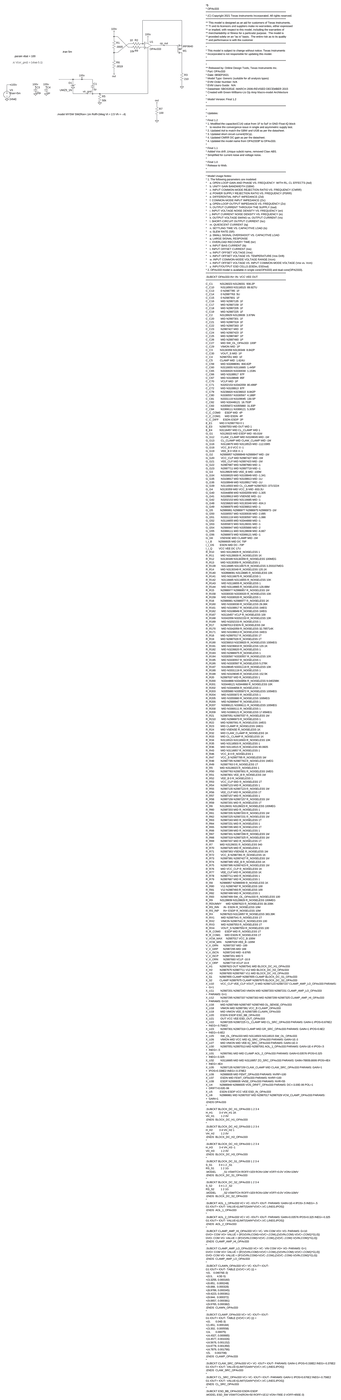
[diagram p0: schematic high_common_mode_shunt_opa333_mosfet.asc, whole sheet]
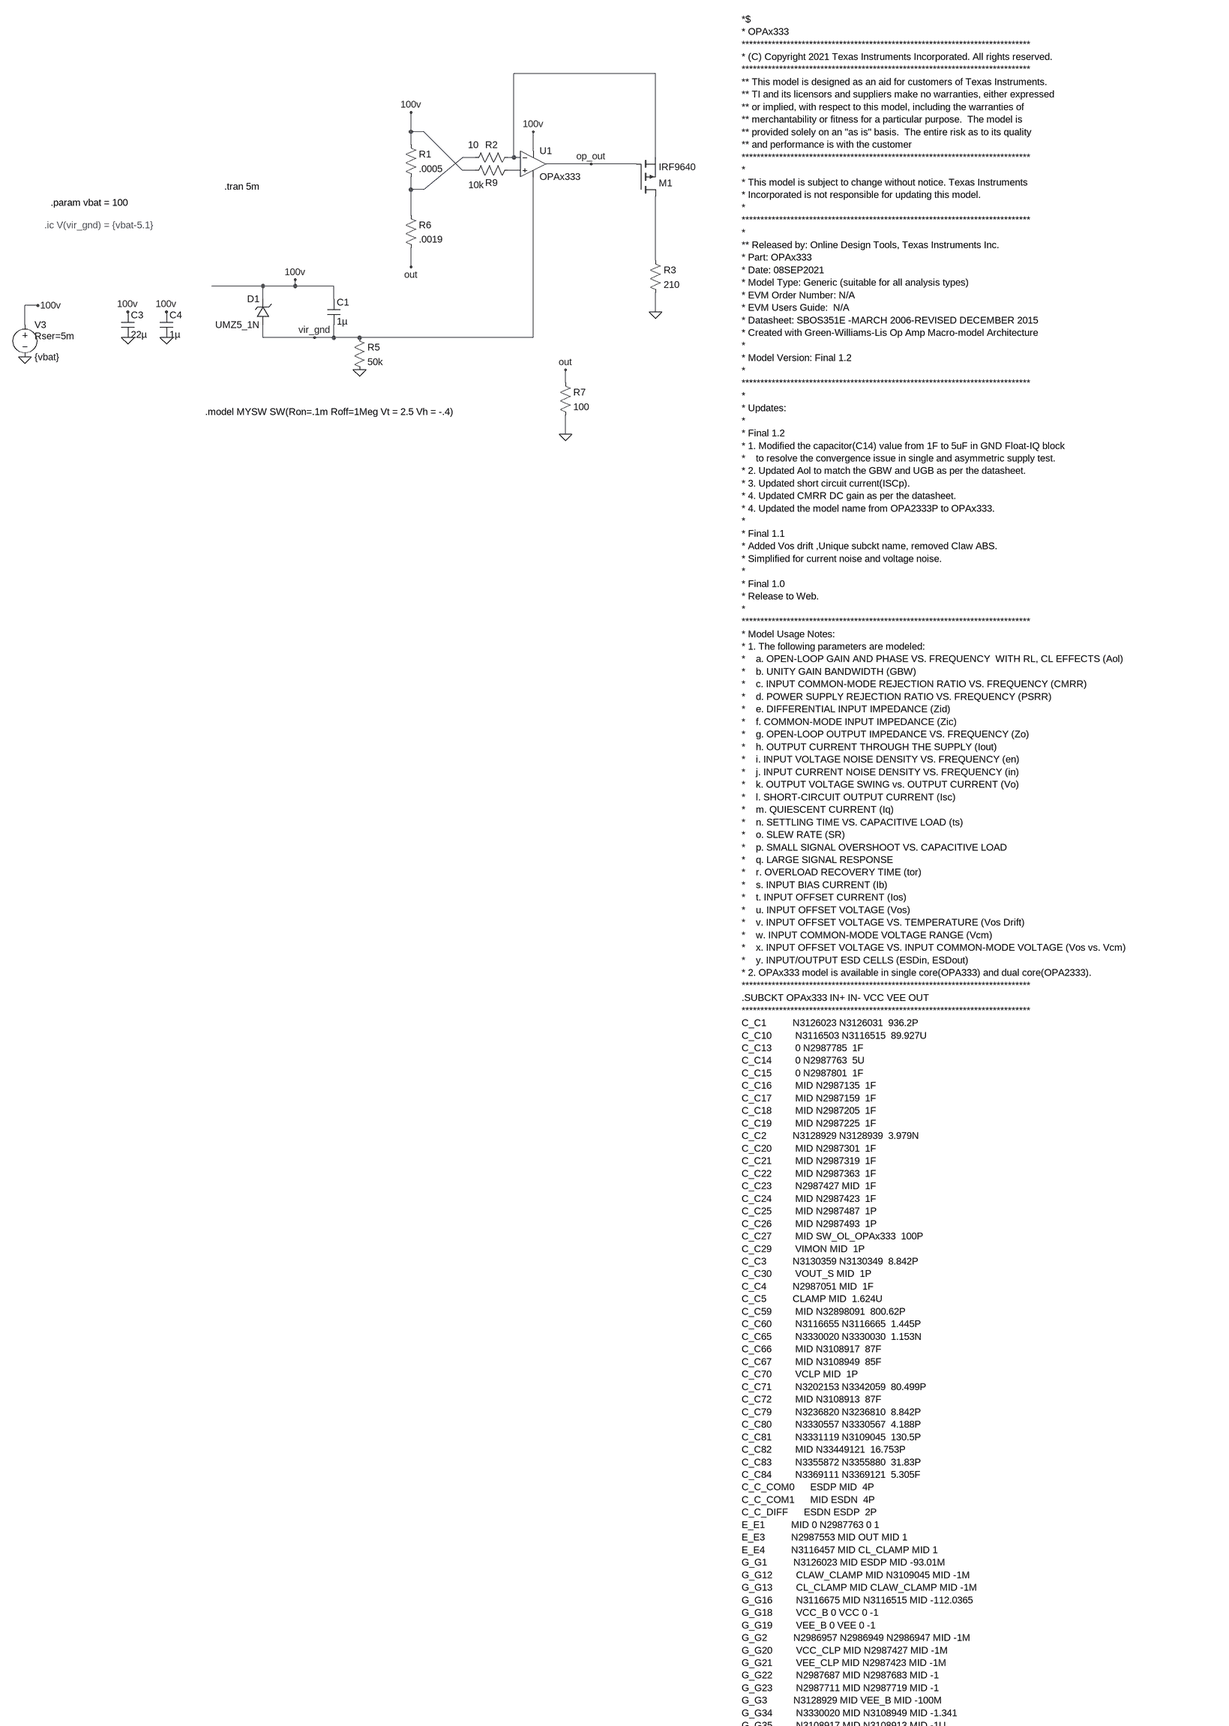
[diagram p1: schematic high_common_mode_shunt_opa333_mosfet.asc, part, row 1 of 3, column 1 of 1]
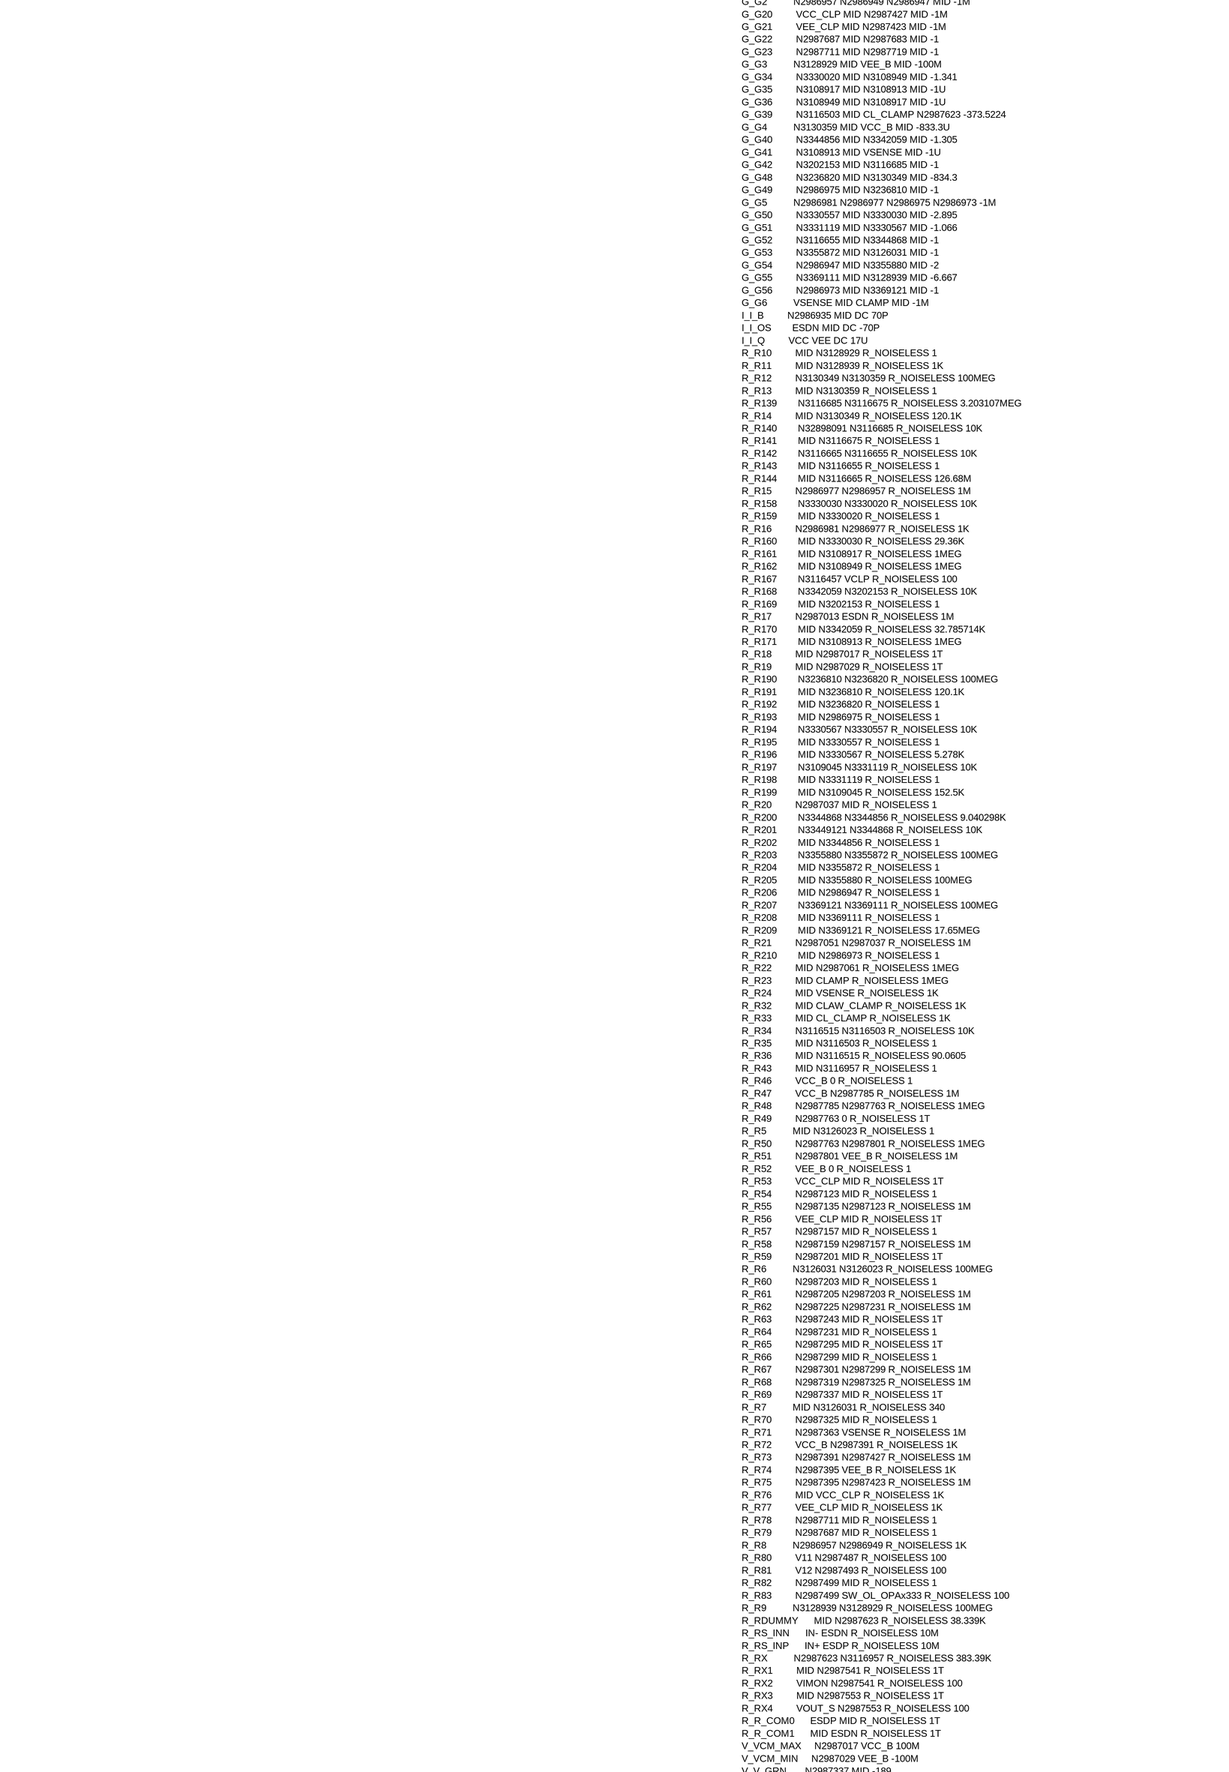
[diagram p2: schematic high_common_mode_shunt_opa333_mosfet.asc, part, row 2 of 3, column 1 of 1]
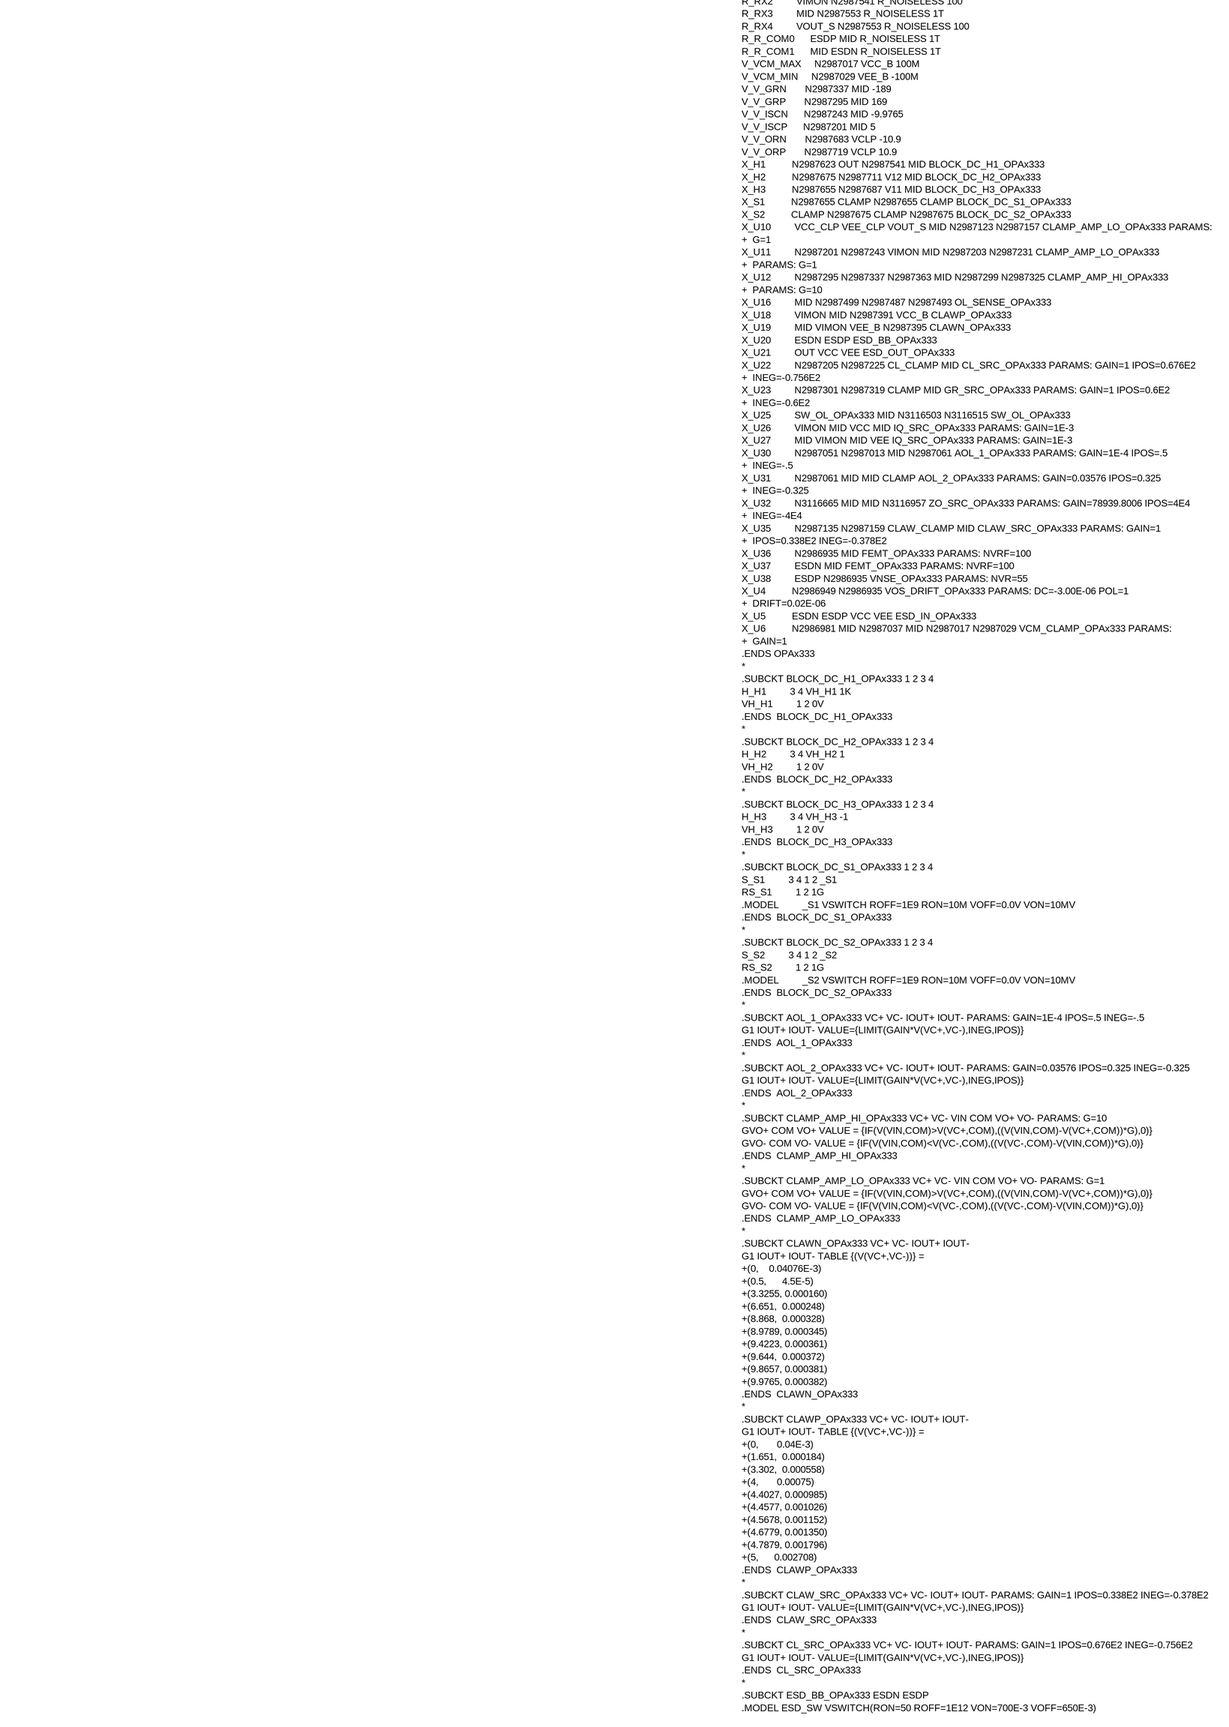
[diagram p3: schematic high_common_mode_shunt_opa333_mosfet.asc, part, row 3 of 3, column 1 of 1]
high_common_mode_shunt_opa333_mosfet.asc, the LTspice schematic file:
Version 4
SHEET 1 3060 12004
WIRE 256 -784 -96 -784
WIRE -352 -640 -352 -688
WIRE -320 -640 -352 -640
WIRE -352 -608 -352 -640
WIRE -48 -592 -48 -640
WIRE -192 -576 -224 -576
WIRE -96 -576 -96 -784
WIRE -96 -576 -112 -576
WIRE -80 -576 -96 -576
WIRE 256 -576 256 -784
WIRE 96 -560 -16 -560
WIRE 208 -560 96 -560
WIRE -224 -544 -320 -640
WIRE -192 -544 -224 -544
WIRE -80 -544 -112 -544
WIRE -352 -496 -352 -528
WIRE -320 -496 -224 -576
WIRE -320 -496 -352 -496
WIRE -352 -432 -352 -496
WIRE 256 -320 256 -480
WIRE -352 -304 -352 -352
WIRE -720 -256 -848 -256
WIRE -640 -256 -640 -272
WIRE -640 -256 -720 -256
WIRE -544 -256 -640 -256
WIRE -720 -224 -720 -256
WIRE -544 -224 -544 -256
WIRE -1280 -208 -1312 -208
WIRE 256 -192 256 -240
WIRE -1312 -160 -1312 -208
WIRE -720 -128 -720 -160
WIRE -592 -128 -720 -128
WIRE -544 -128 -544 -160
WIRE -544 -128 -592 -128
WIRE -480 -128 -544 -128
WIRE -48 -128 -48 -528
WIRE -48 -128 -480 -128
WIRE 32 -16 32 -48
WIRE 32 112 32 64
FLAG -352 -688 100v
FLAG -1312 -80 0
FLAG -1280 -208 100v
FLAG -48 -640 100v
FLAG -640 -272 100v
FLAG 96 -560 op_out
FLAG -352 -304 out
FLAG -480 -48 0
FLAG -592 -128 vir_gnd
FLAG -1056 -128 0
FLAG -1056 -192 100v
FLAG -960 -128 0
FLAG -960 -192 100v
FLAG 32 -48 out
FLAG 32 112 0
FLAG 256 -192 0
SYMBOL res -368 -624 R0
SYMATTR InstName R1
SYMATTR Value .0005
SYMBOL voltage -1312 -176 R0
WINDOW 123 0 0 Left 0
WINDOW 39 24 44 Left 2
SYMATTR SpiceLine Rser=5m
SYMATTR InstName V3
SYMATTR Value {vbat}
SYMBOL OpAmps\\opamp2 -48 -624 R0
SYMATTR InstName U1
SYMATTR Value OPAx333
SYMBOL res -496 -144 R0
SYMATTR InstName R5
SYMATTR Value 50k
SYMBOL cap -560 -224 R0
SYMATTR InstName C1
SYMATTR Value 1µ
SYMBOL cap -1072 -192 R0
SYMATTR InstName C3
SYMATTR Value 22µ
SYMATTR SpiceLine Irms=.5 Rser=.080
SYMBOL cap -976 -192 R0
SYMATTR InstName C4
SYMATTR Value 1µ
SYMATTR SpiceLine Rser=.005
SYMBOL res -368 -448 R0
SYMATTR InstName R6
SYMATTR Value .0019
SYMBOL res 16 -32 R0
SYMATTR InstName R7
SYMATTR Value 100
SYMBOL zener -704 -160 R180
WINDOW 0 24 64 Left 2
WINDOW 3 24 0 Left 2
SYMATTR InstName D1
SYMATTR Value UMZ5_1N
SYMATTR Description Diode
SYMATTR Type diode
SYMBOL res -96 -592 R90
WINDOW 0 0 56 VBottom 2
WINDOW 3 -31 101 VTop 2
SYMATTR InstName R2
SYMATTR Value 10
SYMBOL res -96 -560 R90
WINDOW 0 62 56 VBottom 2
WINDOW 3 37 94 VTop 2
SYMATTR InstName R9
SYMATTR Value 10k
SYMBOL pmos 208 -480 M180
SYMATTR InstName M1
SYMATTR Value IRF9640
SYMBOL res 240 -336 R0
SYMATTR InstName R3
SYMATTR Value 210
TEXT -816 -504 Left 2 !.tran 5m
TEXT -864 56 Left 2 !.model MYSW SW(Ron=.1m Roff=1Meg Vt = 2.5 Vh = -.4)
TEXT -1264 -408 Left 2 ;.ic V(vir_gnd) = {vbat-5.1}
TEXT -1248 -464 Left 2 !.param vbat = 100
TEXT 1848 -920 Left 2 !*$\n* OPAx333\n*****************************************************************************\n* (C) Copyright 2021 Texas Instruments Incorporated. All rights reserved.                                            \n*****************************************************************************\n** This model is designed as an aid for customers of Texas Instruments.\n** TI and its licensors and suppliers make no warranties, either expressed\n** or implied, with respect to this model, including the warranties of \n** merchantability or fitness for a particular purpose.  The model is\n** provided solely on an "as is" basis.  The entire risk as to its quality\n** and performance is with the customer\n*****************************************************************************\n*\n* This model is subject to change without notice. Texas Instruments\n* Incorporated is not responsible for updating this model.\n*\n*****************************************************************************\n*\n** Released by: Online Design Tools, Texas Instruments Inc.\n* Part: OPAx333\n* Date: 08SEP2021\n* Model Type: Generic (suitable for all analysis types)\n* EVM Order Number: N/A \n* EVM Users Guide:  N/A \n* Datasheet: SBOS351E -MARCH 2006-REVISED DECEMBER 2015\n* Created with Green-Williams-Lis Op Amp Macro-model Architecture\n*\n* Model Version: Final 1.2\n*\n*****************************************************************************\n*\n* Updates:\n*\n* Final 1.2\n* 1. Modified the capacitor(C14) value from 1F to 5uF in GND Float-IQ block  \n*    to resolve the convergence issue in single and asymmetric supply test.\n* 2. Updated Aol to match the GBW and UGB as per the datasheet.\n* 3. Updated short circuit current(ISCp).\n* 4. Updated CMRR DC gain as per the datasheet.\n* 4. Updated the model name from OPA2333P to OPAx333.\n*\n* Final 1.1\n* Added Vos drift ,Unique subckt name, removed Claw ABS.\n* Simplified for current noise and voltage noise.\n*\n* Final 1.0\n* Release to Web.\n*\n*****************************************************************************\n* Model Usage Notes:\n* 1. The following parameters are modeled: \n*    a. OPEN-LOOP GAIN AND PHASE VS. FREQUENCY  WITH RL, CL EFFECTS (Aol)\n*    b. UNITY GAIN BANDWIDTH (GBW)\n*    c. INPUT COMMON-MODE REJECTION RATIO VS. FREQUENCY (CMRR)\n*    d. POWER SUPPLY REJECTION RATIO VS. FREQUENCY (PSRR)\n*    e. DIFFERENTIAL INPUT IMPEDANCE (Zid)\n*    f. COMMON-MODE INPUT IMPEDANCE (Zic)\n*    g. OPEN-LOOP OUTPUT IMPEDANCE VS. FREQUENCY (Zo)\n*    h. OUTPUT CURRENT THROUGH THE SUPPLY (Iout)\n*    i. INPUT VOLTAGE NOISE DENSITY VS. FREQUENCY (en)\n*    j. INPUT CURRENT NOISE DENSITY VS. FREQUENCY (in)\n*    k. OUTPUT VOLTAGE SWING vs. OUTPUT CURRENT (Vo)\n*    l. SHORT-CIRCUIT OUTPUT CURRENT (Isc)\n*    m. QUIESCENT CURRENT (Iq)\n*    n. SETTLING TIME VS. CAPACITIVE LOAD (ts)\n*    o. SLEW RATE (SR)\n*    p. SMALL SIGNAL OVERSHOOT VS. CAPACITIVE LOAD\n*    q. LARGE SIGNAL RESPONSE\n*    r. OVERLOAD RECOVERY TIME (tor)\n*    s. INPUT BIAS CURRENT (Ib)\n*    t. INPUT OFFSET CURRENT (Ios)\n*    u. INPUT OFFSET VOLTAGE (Vos)\n*    v. INPUT OFFSET VOLTAGE VS. TEMPERATURE (Vos Drift)\n*    w. INPUT COMMON-MODE VOLTAGE RANGE (Vcm)\n*    x. INPUT OFFSET VOLTAGE VS. INPUT COMMON-MODE VOLTAGE (Vos vs. Vcm)\n*    y. INPUT/OUTPUT ESD CELLS (ESDin, ESDout)\n* 2. OPAx333 model is available in single core(OPA333) and dual core(OPA2333). \n*****************************************************************************\n.SUBCKT OPAx333 IN+ IN- VCC VEE OUT  \n*****************************************************************************\nC_C1          N3126023 N3126031  936.2P   \nC_C10         N3116503 N3116515  89.927U   \nC_C13         0 N2987785  1F   \nC_C14         0 N2987763  5U   \nC_C15         0 N2987801  1F   \nC_C16         MID N2987135  1F   \nC_C17         MID N2987159  1F   \nC_C18         MID N2987205  1F   \nC_C19         MID N2987225  1F   \nC_C2          N3128929 N3128939  3.979N   \nC_C20         MID N2987301  1F   \nC_C21         MID N2987319  1F   \nC_C22         MID N2987363  1F   \nC_C23         N2987427 MID  1F   \nC_C24         MID N2987423  1F   \nC_C25         MID N2987487  1P   \nC_C26         MID N2987493  1P   \nC_C27         MID SW_OL_OPAx333  100P   \nC_C29         VIMON MID  1P   \nC_C3          N3130359 N3130349  8.842P   \nC_C30         VOUT_S MID  1P   \nC_C4          N2987051 MID  1F   \nC_C5          CLAMP MID  1.624U   \nC_C59         MID N32898091  800.62P   \nC_C60         N3116655 N3116665  1.445P   \nC_C65         N3330020 N3330030  1.153N   \nC_C66         MID N3108917  87F   \nC_C67         MID N3108949  85F   \nC_C70         VCLP MID  1P   \nC_C71         N3202153 N3342059  80.499P   \nC_C72         MID N3108913  87F   \nC_C79         N3236820 N3236810  8.842P   \nC_C80         N3330557 N3330567  4.188P   \nC_C81         N3331119 N3109045  130.5P   \nC_C82         MID N33449121  16.753P   \nC_C83         N3355872 N3355880  31.83P   \nC_C84         N3369111 N3369121  5.305F   \nC_C_COM0      ESDP MID  4P   \nC_C_COM1      MID ESDN  4P   \nC_C_DIFF      ESDN ESDP  2P   \nE_E1          MID 0 N2987763 0 1\nE_E3          N2987553 MID OUT MID 1\nE_E4          N3116457 MID CL_CLAMP MID 1\nG_G1          N3126023 MID ESDP MID -93.01M\nG_G12         CLAW_CLAMP MID N3109045 MID -1M\nG_G13         CL_CLAMP MID CLAW_CLAMP MID -1M\nG_G16         N3116675 MID N3116515 MID -112.0365\nG_G18         VCC_B 0 VCC 0 -1\nG_G19         VEE_B 0 VEE 0 -1\nG_G2          N2986957 N2986949 N2986947 MID -1M\nG_G20         VCC_CLP MID N2987427 MID -1M\nG_G21         VEE_CLP MID N2987423 MID -1M\nG_G22         N2987687 MID N2987683 MID -1\nG_G23         N2987711 MID N2987719 MID -1\nG_G3          N3128929 MID VEE_B MID -100M\nG_G34         N3330020 MID N3108949 MID -1.341\nG_G35         N3108917 MID N3108913 MID -1U\nG_G36         N3108949 MID N3108917 MID -1U\nG_G39         N3116503 MID CL_CLAMP N2987623 -373.5224\nG_G4          N3130359 MID VCC_B MID -833.3U\nG_G40         N3344856 MID N3342059 MID -1.305\nG_G41         N3108913 MID VSENSE MID -1U\nG_G42         N3202153 MID N3116685 MID -1\nG_G48         N3236820 MID N3130349 MID -834.3\nG_G49         N2986975 MID N3236810 MID -1\nG_G5          N2986981 N2986977 N2986975 N2986973 -1M\nG_G50         N3330557 MID N3330030 MID -2.895\nG_G51         N3331119 MID N3330567 MID -1.066\nG_G52         N3116655 MID N3344868 MID -1\nG_G53         N3355872 MID N3126031 MID -1\nG_G54         N2986947 MID N3355880 MID -2\nG_G55         N3369111 MID N3128939 MID -6.667\nG_G56         N2986973 MID N3369121 MID -1\nG_G6          VSENSE MID CLAMP MID -1M\nI_I_B         N2986935 MID DC 70P  \nI_I_OS        ESDN MID DC -70P  \nI_I_Q         VCC VEE DC 17U  \nR_R10         MID N3128929 R_NOISELESS 1\nR_R11         MID N3128939 R_NOISELESS 1K\nR_R12         N3130349 N3130359 R_NOISELESS 100MEG\nR_R13         MID N3130359 R_NOISELESS 1\nR_R139        N3116685 N3116675 R_NOISELESS 3.203107MEG\nR_R14         MID N3130349 R_NOISELESS 120.1K\nR_R140        N32898091 N3116685 R_NOISELESS 10K\nR_R141        MID N3116675 R_NOISELESS 1\nR_R142        N3116665 N3116655 R_NOISELESS 10K\nR_R143        MID N3116655 R_NOISELESS 1\nR_R144        MID N3116665 R_NOISELESS 126.68M\nR_R15         N2986977 N2986957 R_NOISELESS 1M\nR_R158        N3330030 N3330020 R_NOISELESS 10K\nR_R159        MID N3330020 R_NOISELESS 1\nR_R16         N2986981 N2986977 R_NOISELESS 1K\nR_R160        MID N3330030 R_NOISELESS 29.36K\nR_R161        MID N3108917 R_NOISELESS 1MEG\nR_R162        MID N3108949 R_NOISELESS 1MEG\nR_R167        N3116457 VCLP R_NOISELESS 100\nR_R168        N3342059 N3202153 R_NOISELESS 10K\nR_R169        MID N3202153 R_NOISELESS 1\nR_R17         N2987013 ESDN R_NOISELESS 1M\nR_R170        MID N3342059 R_NOISELESS 32.785714K\nR_R171        MID N3108913 R_NOISELESS 1MEG\nR_R18         MID N2987017 R_NOISELESS 1T\nR_R19         MID N2987029 R_NOISELESS 1T\nR_R190        N3236810 N3236820 R_NOISELESS 100MEG\nR_R191        MID N3236810 R_NOISELESS 120.1K\nR_R192        MID N3236820 R_NOISELESS 1\nR_R193        MID N2986975 R_NOISELESS 1\nR_R194        N3330567 N3330557 R_NOISELESS 10K\nR_R195        MID N3330557 R_NOISELESS 1\nR_R196        MID N3330567 R_NOISELESS 5.278K\nR_R197        N3109045 N3331119 R_NOISELESS 10K\nR_R198        MID N3331119 R_NOISELESS 1\nR_R199        MID N3109045 R_NOISELESS 152.5K\nR_R20         N2987037 MID R_NOISELESS 1\nR_R200        N3344868 N3344856 R_NOISELESS 9.040298K\nR_R201        N33449121 N3344868 R_NOISELESS 10K\nR_R202        MID N3344856 R_NOISELESS 1\nR_R203        N3355880 N3355872 R_NOISELESS 100MEG\nR_R204        MID N3355872 R_NOISELESS 1\nR_R205        MID N3355880 R_NOISELESS 100MEG\nR_R206        MID N2986947 R_NOISELESS 1\nR_R207        N3369121 N3369111 R_NOISELESS 100MEG\nR_R208        MID N3369111 R_NOISELESS 1\nR_R209        MID N3369121 R_NOISELESS 17.65MEG\nR_R21         N2987051 N2987037 R_NOISELESS 1M\nR_R210        MID N2986973 R_NOISELESS 1\nR_R22         MID N2987061 R_NOISELESS 1MEG\nR_R23         MID CLAMP R_NOISELESS 1MEG\nR_R24         MID VSENSE R_NOISELESS 1K\nR_R32         MID CLAW_CLAMP R_NOISELESS 1K\nR_R33         MID CL_CLAMP R_NOISELESS 1K\nR_R34         N3116515 N3116503 R_NOISELESS 10K\nR_R35         MID N3116503 R_NOISELESS 1\nR_R36         MID N3116515 R_NOISELESS 90.0605\nR_R43         MID N3116957 R_NOISELESS 1\nR_R46         VCC_B 0 R_NOISELESS 1\nR_R47         VCC_B N2987785 R_NOISELESS 1M\nR_R48         N2987785 N2987763 R_NOISELESS 1MEG\nR_R49         N2987763 0 R_NOISELESS 1T\nR_R5          MID N3126023 R_NOISELESS 1\nR_R50         N2987763 N2987801 R_NOISELESS 1MEG\nR_R51         N2987801 VEE_B R_NOISELESS 1M\nR_R52         VEE_B 0 R_NOISELESS 1\nR_R53         VCC_CLP MID R_NOISELESS 1T\nR_R54         N2987123 MID R_NOISELESS 1\nR_R55         N2987135 N2987123 R_NOISELESS 1M\nR_R56         VEE_CLP MID R_NOISELESS 1T\nR_R57         N2987157 MID R_NOISELESS 1\nR_R58         N2987159 N2987157 R_NOISELESS 1M\nR_R59         N2987201 MID R_NOISELESS 1T\nR_R6          N3126031 N3126023 R_NOISELESS 100MEG\nR_R60         N2987203 MID R_NOISELESS 1\nR_R61         N2987205 N2987203 R_NOISELESS 1M\nR_R62         N2987225 N2987231 R_NOISELESS 1M\nR_R63         N2987243 MID R_NOISELESS 1T\nR_R64         N2987231 MID R_NOISELESS 1\nR_R65         N2987295 MID R_NOISELESS 1T\nR_R66         N2987299 MID R_NOISELESS 1\nR_R67         N2987301 N2987299 R_NOISELESS 1M\nR_R68         N2987319 N2987325 R_NOISELESS 1M\nR_R69         N2987337 MID R_NOISELESS 1T\nR_R7          MID N3126031 R_NOISELESS 340\nR_R70         N2987325 MID R_NOISELESS 1\nR_R71         N2987363 VSENSE R_NOISELESS 1M\nR_R72         VCC_B N2987391 R_NOISELESS 1K\nR_R73         N2987391 N2987427 R_NOISELESS 1M\nR_R74         N2987395 VEE_B R_NOISELESS 1K\nR_R75         N2987395 N2987423 R_NOISELESS 1M\nR_R76         MID VCC_CLP R_NOISELESS 1K\nR_R77         VEE_CLP MID R_NOISELESS 1K\nR_R78         N2987711 MID R_NOISELESS 1\nR_R79         N2987687 MID R_NOISELESS 1\nR_R8          N2986957 N2986949 R_NOISELESS 1K\nR_R80         V11 N2987487 R_NOISELESS 100\nR_R81         V12 N2987493 R_NOISELESS 100\nR_R82         N2987499 MID R_NOISELESS 1\nR_R83         N2987499 SW_OL_OPAx333 R_NOISELESS 100\nR_R9          N3128939 N3128929 R_NOISELESS 100MEG\nR_RDUMMY      MID N2987623 R_NOISELESS 38.339K\nR_RS_INN      IN- ESDN R_NOISELESS 10M\nR_RS_INP      IN+ ESDP R_NOISELESS 10M\nR_RX          N2987623 N3116957 R_NOISELESS 383.39K\nR_RX1         MID N2987541 R_NOISELESS 1T\nR_RX2         VIMON N2987541 R_NOISELESS 100\nR_RX3         MID N2987553 R_NOISELESS 1T\nR_RX4         VOUT_S N2987553 R_NOISELESS 100\nR_R_COM0      ESDP MID R_NOISELESS 1T\nR_R_COM1      MID ESDN R_NOISELESS 1T\nV_VCM_MAX     N2987017 VCC_B 100M\nV_VCM_MIN     N2987029 VEE_B -100M\nV_V_GRN       N2987337 MID -189\nV_V_GRP       N2987295 MID 169\nV_V_ISCN      N2987243 MID -9.9765\nV_V_ISCP      N2987201 MID 5\nV_V_ORN       N2987683 VCLP -10.9\nV_V_ORP       N2987719 VCLP 10.9\nX_H1          N2987623 OUT N2987541 MID BLOCK_DC_H1_OPAx333 \nX_H2          N2987675 N2987711 V12 MID BLOCK_DC_H2_OPAx333 \nX_H3          N2987655 N2987687 V11 MID BLOCK_DC_H3_OPAx333 \nX_S1          N2987655 CLAMP N2987655 CLAMP BLOCK_DC_S1_OPAx333 \nX_S2          CLAMP N2987675 CLAMP N2987675 BLOCK_DC_S2_OPAx333 \nX_U10         VCC_CLP VEE_CLP VOUT_S MID N2987123 N2987157 CLAMP_AMP_LO_OPAx333 PARAMS:\n+  G=1\nX_U11         N2987201 N2987243 VIMON MID N2987203 N2987231 CLAMP_AMP_LO_OPAx333\n+  PARAMS: G=1\nX_U12         N2987295 N2987337 N2987363 MID N2987299 N2987325 CLAMP_AMP_HI_OPAx333\n+  PARAMS: G=10\nX_U16         MID N2987499 N2987487 N2987493 OL_SENSE_OPAx333\nX_U18         VIMON MID N2987391 VCC_B CLAWP_OPAx333\nX_U19         MID VIMON VEE_B N2987395 CLAWN_OPAx333\nX_U20         ESDN ESDP ESD_BB_OPAx333\nX_U21         OUT VCC VEE ESD_OUT_OPAx333\nX_U22         N2987205 N2987225 CL_CLAMP MID CL_SRC_OPAx333 PARAMS: GAIN=1 IPOS=0.676E2\n+  INEG=-0.756E2\nX_U23         N2987301 N2987319 CLAMP MID GR_SRC_OPAx333 PARAMS: GAIN=1 IPOS=0.6E2\n+  INEG=-0.6E2\nX_U25         SW_OL_OPAx333 MID N3116503 N3116515 SW_OL_OPAx333\nX_U26         VIMON MID VCC MID IQ_SRC_OPAx333 PARAMS: GAIN=1E-3\nX_U27         MID VIMON MID VEE IQ_SRC_OPAx333 PARAMS: GAIN=1E-3\nX_U30         N2987051 N2987013 MID N2987061 AOL_1_OPAx333 PARAMS: GAIN=1E-4 IPOS=.5\n+  INEG=-.5\nX_U31         N2987061 MID MID CLAMP AOL_2_OPAx333 PARAMS: GAIN=0.03576 IPOS=0.325\n+  INEG=-0.325\nX_U32         N3116665 MID MID N3116957 ZO_SRC_OPAx333 PARAMS: GAIN=78939.8006 IPOS=4E4\n+  INEG=-4E4\nX_U35         N2987135 N2987159 CLAW_CLAMP MID CLAW_SRC_OPAx333 PARAMS: GAIN=1\n+  IPOS=0.338E2 INEG=-0.378E2\nX_U36         N2986935 MID FEMT_OPAx333 PARAMS: NVRF=100\nX_U37         ESDN MID FEMT_OPAx333 PARAMS: NVRF=100\nX_U38         ESDP N2986935 VNSE_OPAx333 PARAMS: NVR=55\nX_U4          N2986949 N2986935 VOS_DRIFT_OPAx333 PARAMS: DC=-3.00E-06 POL=1\n+  DRIFT=0.02E-06\nX_U5          ESDN ESDP VCC VEE ESD_IN_OPAx333\nX_U6          N2986981 MID N2987037 MID N2987017 N2987029 VCM_CLAMP_OPAx333 PARAMS:\n+  GAIN=1\n.ENDS OPAx333\n*\n.SUBCKT BLOCK_DC_H1_OPAx333 1 2 3 4  \nH_H1         3 4 VH_H1 1K\nVH_H1         1 2 0V\n.ENDS  BLOCK_DC_H1_OPAx333\n*\n.SUBCKT BLOCK_DC_H2_OPAx333 1 2 3 4  \nH_H2         3 4 VH_H2 1\nVH_H2         1 2 0V\n.ENDS  BLOCK_DC_H2_OPAx333\n*\n.SUBCKT BLOCK_DC_H3_OPAx333 1 2 3 4  \nH_H3         3 4 VH_H3 -1\nVH_H3         1 2 0V\n.ENDS  BLOCK_DC_H3_OPAx333\n*\n.SUBCKT BLOCK_DC_S1_OPAx333 1 2 3 4  \nS_S1         3 4 1 2 _S1\nRS_S1         1 2 1G\n.MODEL         _S1 VSWITCH ROFF=1E9 RON=10M VOFF=0.0V VON=10MV\n.ENDS  BLOCK_DC_S1_OPAx333\n*\n.SUBCKT BLOCK_DC_S2_OPAx333 1 2 3 4  \nS_S2         3 4 1 2 _S2\nRS_S2         1 2 1G\n.MODEL         _S2 VSWITCH ROFF=1E9 RON=10M VOFF=0.0V VON=10MV\n.ENDS  BLOCK_DC_S2_OPAx333\n*\n.SUBCKT AOL_1_OPAx333 VC+ VC- IOUT+ IOUT- PARAMS: GAIN=1E-4 IPOS=.5 INEG=-.5\nG1 IOUT+ IOUT- VALUE={LIMIT(GAIN*V(VC+,VC-),INEG,IPOS)}\n.ENDS  AOL_1_OPAx333\n*\n.SUBCKT AOL_2_OPAx333 VC+ VC- IOUT+ IOUT- PARAMS: GAIN=0.03576 IPOS=0.325 INEG=-0.325\nG1 IOUT+ IOUT- VALUE={LIMIT(GAIN*V(VC+,VC-),INEG,IPOS)}\n.ENDS  AOL_2_OPAx333\n*\n.SUBCKT CLAMP_AMP_HI_OPAx333 VC+ VC- VIN COM VO+ VO- PARAMS: G=10\nGVO+ COM VO+ VALUE = {IF(V(VIN,COM)>V(VC+,COM),((V(VIN,COM)-V(VC+,COM))*G),0)}\nGVO- COM VO- VALUE = {IF(V(VIN,COM)<V(VC-,COM),((V(VC-,COM)-V(VIN,COM))*G),0)}\n.ENDS  CLAMP_AMP_HI_OPAx333\n*\n.SUBCKT CLAMP_AMP_LO_OPAx333 VC+ VC- VIN COM VO+ VO- PARAMS: G=1\nGVO+ COM VO+ VALUE = {IF(V(VIN,COM)>V(VC+,COM),((V(VIN,COM)-V(VC+,COM))*G),0)}\nGVO- COM VO- VALUE = {IF(V(VIN,COM)<V(VC-,COM),((V(VC-,COM)-V(VIN,COM))*G),0)}\n.ENDS  CLAMP_AMP_LO_OPAx333\n*\n.SUBCKT CLAWN_OPAx333 VC+ VC- IOUT+ IOUT-\nG1 IOUT+ IOUT- TABLE {(V(VC+,VC-))} =\n+(0,    0.04076E-3)\n+(0.5,      4.5E-5)\n+(3.3255, 0.000160)\n+(6.651,  0.000248)\n+(8.868,  0.000328)\n+(8.9789, 0.000345)\n+(9.4223, 0.000361)\n+(9.644,  0.000372)\n+(9.8657, 0.000381)\n+(9.9765, 0.000382)\n.ENDS  CLAWN_OPAx333\n*\n.SUBCKT CLAWP_OPAx333 VC+ VC- IOUT+ IOUT-\nG1 IOUT+ IOUT- TABLE {(V(VC+,VC-))} =\n+(0,       0.04E-3)\n+(1.651,  0.000184)\n+(3.302,  0.000558)\n+(4,       0.00075)\n+(4.4027, 0.000985)\n+(4.4577, 0.001026)\n+(4.5678, 0.001152)\n+(4.6779, 0.001350)\n+(4.7879, 0.001796)\n+(5,      0.002708)\n.ENDS  CLAWP_OPAx333\n*\n.SUBCKT CLAW_SRC_OPAx333 VC+ VC- IOUT+ IOUT- PARAMS: GAIN=1 IPOS=0.338E2 INEG=-0.378E2\nG1 IOUT+ IOUT- VALUE={LIMIT(GAIN*V(VC+,VC-),INEG,IPOS)}\n.ENDS  CLAW_SRC_OPAx333\n*\n.SUBCKT CL_SRC_OPAx333 VC+ VC- IOUT+ IOUT- PARAMS: GAIN=1 IPOS=0.676E2 INEG=-0.756E2\nG1 IOUT+ IOUT- VALUE={LIMIT(GAIN*V(VC+,VC-),INEG,IPOS)}\n.ENDS  CL_SRC_OPAx333\n*\n.SUBCKT ESD_BB_OPAx333 ESDN ESDP\n.MODEL ESD_SW VSWITCH(RON=50 ROFF=1E12 VON=700E-3 VOFF=650E-3)\nS1 ESDN ESDP ESDN ESDP ESD_SW\nS2 ESDP ESDN ESDP ESDN ESD_SW\n.ENDS  ESD_BB_OPAx333\n*\n.SUBCKT ESD_IN_OPAx333 ESDN ESDP VCC VEE\n.MODEL ESD_SW VSWITCH(RON=50 ROFF=1E12 VON=500E-3 VOFF=450E-3)\nS1 ESDN VCC ESDN VCC ESD_SW\nS2 ESDP VCC ESDP VCC ESD_SW\nS3 VEE ESDN VEE ESDN ESD_SW\nS4 VEE ESDP VEE ESDP ESD_SW\n.ENDS  ESD_IN_OPAx333\n*\n.SUBCKT ESD_OUT_OPAx333 OUT VCC VEE\n.MODEL ESD_SW VSWITCH(RON=50 ROFF=1E12 VON=500E-3 VOFF=450E-3)\nS1 OUT VCC OUT VCC ESD_SW\nS2 VEE OUT VEE OUT ESD_SW\n.ENDS  ESD_OUT_OPAx333\n*\n.SUBCKT FEMT_OPAx333 1 2 PARAMS: NVRF=100\nE1 3 0 5 0 10\nR1 5 0 {1.184*PWR(NVRF,2)}\nR2 5 0 {1.184*PWR(NVRF,2)}\nG1 1 2 3 0 1E-6\n.ENDS  FEMT_OPAx333\n*\n.SUBCKT GR_SRC_OPAx333 VC+ VC- IOUT+ IOUT- PARAMS: GAIN=1 IPOS=0.6E2 INEG=-0.6E2\nG1 IOUT+ IOUT- VALUE={LIMIT(GAIN*V(VC+,VC-),INEG,IPOS)}\n.ENDS  GR_SRC_OPAx333\n*\n.SUBCKT IQ_SRC_OPAx333 VC+ VC- IOUT+ IOUT- PARAMS: GAIN=1E-3\nG1 IOUT+ IOUT- VALUE={IF( (V(VC+,VC-)<=0),0,GAIN*V(VC+,VC-) )}\n.ENDS  IQ_SRC_OPAx333\n*\n.SUBCKT OL_SENSE_OPAx333 COM SW+ OLN OLP\nGSW+ COM SW+ VALUE = {IF((V(OLN,COM)>10E-3 | V(OLP,COM)>10E-3),1,0)}\n.ENDS  OL_SENSE_OPAx333\n*\n.SUBCKT SW_OL_OPAx333 SW_OL_OPAx333 MID CAP_L CAP_R\n.MODEL OL_SW VSWITCH(RON=1E-3 ROFF=1E9 VON=900E-3 VOFF=800E-3)\nS1 CAP_L CAP_R SW_OL_OPAx333 MID OL_SW\n.ENDS  SW_OL_OPAx333\n*\n.SUBCKT VCM_CLAMP_OPAx333 VIN+ VIN- IOUT- IOUT+ VP+ VP- PARAMS: GAIN=1\nG1 IOUT+ IOUT- VALUE={LIMIT(GAIN*V(VIN+,VIN-),V(VP-,VIN-), V(VP+,VIN-))}\n.ENDS  VCM_CLAMP_OPAx333\n*\n.SUBCKT VNSE_OPAx333 1 2 PARAMS: NVR=55\nR4 5 0 {1.184*PWR(NVR,2)}\nR5 5 0 {1.184*PWR(NVR,2)}\nE3 1 2 5 0 10\n.ENDS  VNSE_OPAx333\n*\n.SUBCKT VOS_DRIFT_OPAx333 VOS+ VOS- PARAMS: DC=-3.50E-06 POL=1 DRIFT=0.02E-06\nE1 VOS+ VOS- VALUE={DC+POL*DRIFT*(TEMP-27)}\n.ENDS  VOS_DRIFT_OPAx333\n*\n.SUBCKT ZO_SRC_OPAx333 VC+ VC- IOUT+ IOUT- PARAMS: GAIN=78939.8006 IPOS=4E4 INEG=-4E4\nG1 IOUT+ IOUT- VALUE={LIMIT(GAIN*V(VC+,VC-),INEG,IPOS)}\n.ENDS  ZO_SRC_OPAx333\n*\n.MODEL R_NOISELESS RES (T_ABS=-273.15)\n*

The netlist it stands for:
* high_common_mode_shunt_opa333_mosfet.asc
R1 100v N002 .0005
V3 100v 0 {vbat} Rser=5m
XU1 N003 N001 100v vir_gnd op_out OPAx333  ; pins In+ In- V+ V- OUT
R5 vir_gnd 0 50k
C1 100v vir_gnd 1µ
C3 100v 0 22µ Irms=.5 Rser=.080
C4 100v 0 1µ Rser=.005
R6 N002 out .0019
R7 out 0 100
D1 vir_gnd 100v UMZ5_1N
R2 N001 N002 10
R9 N003 100v 10k
M1 N004 op_out N001 N001 IRF9640
R3 N004 0 210
.model D D
.lib standard.dio
.model NMOS NMOS
.model PMOS PMOS
.lib standard.mos
.tran 5m
.model MYSW SW(Ron=.1m Roff=1Meg Vt = 2.5 Vh = -.4)
* .ic V(vir_gnd) = {vbat-5.1}
.param vbat = 100
*$
* OPAx333
*****************************************************************************
* (C) Copyright 2021 Texas Instruments Incorporated. All rights reserved.
*****************************************************************************
** This model is designed as an aid for customers of Texas Instruments.
** TI and its licensors and suppliers make no warranties, either expressed
** or implied, with respect to this model, including the warranties of
** merchantability or fitness for a particular purpose.  The model is
** provided solely on an "as is" basis.  The entire risk as to its quality
** and performance is with the customer
*****************************************************************************
*
* This model is subject to change without notice. Texas Instruments
* Incorporated is not responsible for updating this model.
*
*****************************************************************************
*
** Released by: Online Design Tools, Texas Instruments Inc.
* Part: OPAx333
* Date: 08SEP2021
* Model Type: Generic (suitable for all analysis types)
* EVM Order Number: N/A
* EVM Users Guide:  N/A
* Datasheet: SBOS351E -MARCH 2006-REVISED DECEMBER 2015
* Created with Green-Williams-Lis Op Amp Macro-model Architecture
*
* Model Version: Final 1.2
*
*****************************************************************************
*
* Updates:
*
* Final 1.2
* 1. Modified the capacitor(C14) value from 1F to 5uF in GND Float-IQ block
*    to resolve the convergence issue in single and asymmetric supply test.
* 2. Updated Aol to match the GBW and UGB as per the datasheet.
* 3. Updated short circuit current(ISCp).
* 4. Updated CMRR DC gain as per the datasheet.
* 4. Updated the model name from OPA2333P to OPAx333.
*
* Final 1.1
* Added Vos drift ,Unique subckt name, removed Claw ABS.
* Simplified for current noise and voltage noise.
*
* Final 1.0
* Release to Web.
*
*****************************************************************************
* Model Usage Notes:
* 1. The following parameters are modeled:
*    a. OPEN-LOOP GAIN AND PHASE VS. FREQUENCY  WITH RL, CL EFFECTS (Aol)
*    b. UNITY GAIN BANDWIDTH (GBW)
*    c. INPUT COMMON-MODE REJECTION RATIO VS. FREQUENCY (CMRR)
*    d. POWER SUPPLY REJECTION RATIO VS. FREQUENCY (PSRR)
*    e. DIFFERENTIAL INPUT IMPEDANCE (Zid)
*    f. COMMON-MODE INPUT IMPEDANCE (Zic)
*    g. OPEN-LOOP OUTPUT IMPEDANCE VS. FREQUENCY (Zo)
*    h. OUTPUT CURRENT THROUGH THE SUPPLY (Iout)
*    i. INPUT VOLTAGE NOISE DENSITY VS. FREQUENCY (en)
*    j. INPUT CURRENT NOISE DENSITY VS. FREQUENCY (in)
*    k. OUTPUT VOLTAGE SWING vs. OUTPUT CURRENT (Vo)
*    l. SHORT-CIRCUIT OUTPUT CURRENT (Isc)
*    m. QUIESCENT CURRENT (Iq)
*    n. SETTLING TIME VS. CAPACITIVE LOAD (ts)
*    o. SLEW RATE (SR)
*    p. SMALL SIGNAL OVERSHOOT VS. CAPACITIVE LOAD
*    q. LARGE SIGNAL RESPONSE
*    r. OVERLOAD RECOVERY TIME (tor)
*    s. INPUT BIAS CURRENT (Ib)
*    t. INPUT OFFSET CURRENT (Ios)
*    u. INPUT OFFSET VOLTAGE (Vos)
*    v. INPUT OFFSET VOLTAGE VS. TEMPERATURE (Vos Drift)
*    w. INPUT COMMON-MODE VOLTAGE RANGE (Vcm)
*    x. INPUT OFFSET VOLTAGE VS. INPUT COMMON-MODE VOLTAGE (Vos vs. Vcm)
*    y. INPUT/OUTPUT ESD CELLS (ESDin, ESDout)
* 2. OPAx333 model is available in single core(OPA333) and dual core(OPA2333).
*****************************************************************************
.SUBCKT OPAx333 IN+ IN- VCC VEE OUT
*****************************************************************************
C_C1          N3126023 N3126031  936.2P
C_C10         N3116503 N3116515  89.927U
C_C13         0 N2987785  1F
C_C14         0 N2987763  5U
C_C15         0 N2987801  1F
C_C16         MID N2987135  1F
C_C17         MID N2987159  1F
C_C18         MID N2987205  1F
C_C19         MID N2987225  1F
C_C2          N3128929 N3128939  3.979N
C_C20         MID N2987301  1F
C_C21         MID N2987319  1F
C_C22         MID N2987363  1F
C_C23         N2987427 MID  1F
C_C24         MID N2987423  1F
C_C25         MID N2987487  1P
C_C26         MID N2987493  1P
C_C27         MID SW_OL_OPAx333  100P
C_C29         VIMON MID  1P
C_C3          N3130359 N3130349  8.842P
C_C30         VOUT_S MID  1P
C_C4          N2987051 MID  1F
C_C5          CLAMP MID  1.624U
C_C59         MID N32898091  800.62P
C_C60         N3116655 N3116665  1.445P
C_C65         N3330020 N3330030  1.153N
C_C66         MID N3108917  87F
C_C67         MID N3108949  85F
C_C70         VCLP MID  1P
C_C71         N3202153 N3342059  80.499P
C_C72         MID N3108913  87F
C_C79         N3236820 N3236810  8.842P
C_C80         N3330557 N3330567  4.188P
C_C81         N3331119 N3109045  130.5P
C_C82         MID N33449121  16.753P
C_C83         N3355872 N3355880  31.83P
C_C84         N3369111 N3369121  5.305F
C_C_COM0      ESDP MID  4P
C_C_COM1      MID ESDN  4P
C_C_DIFF      ESDN ESDP  2P
E_E1          MID 0 N2987763 0 1
E_E3          N2987553 MID OUT MID 1
E_E4          N3116457 MID CL_CLAMP MID 1
G_G1          N3126023 MID ESDP MID -93.01M
G_G12         CLAW_CLAMP MID N3109045 MID -1M
G_G13         CL_CLAMP MID CLAW_CLAMP MID -1M
G_G16         N3116675 MID N3116515 MID -112.0365
G_G18         VCC_B 0 VCC 0 -1
G_G19         VEE_B 0 VEE 0 -1
G_G2          N2986957 N2986949 N2986947 MID -1M
G_G20         VCC_CLP MID N2987427 MID -1M
G_G21         VEE_CLP MID N2987423 MID -1M
G_G22         N2987687 MID N2987683 MID -1
G_G23         N2987711 MID N2987719 MID -1
G_G3          N3128929 MID VEE_B MID -100M
G_G34         N3330020 MID N3108949 MID -1.341
G_G35         N3108917 MID N3108913 MID -1U
G_G36         N3108949 MID N3108917 MID -1U
G_G39         N3116503 MID CL_CLAMP N2987623 -373.5224
G_G4          N3130359 MID VCC_B MID -833.3U
G_G40         N3344856 MID N3342059 MID -1.305
G_G41         N3108913 MID VSENSE MID -1U
G_G42         N3202153 MID N3116685 MID -1
G_G48         N3236820 MID N3130349 MID -834.3
G_G49         N2986975 MID N3236810 MID -1
G_G5          N2986981 N2986977 N2986975 N2986973 -1M
G_G50         N3330557 MID N3330030 MID -2.895
G_G51         N3331119 MID N3330567 MID -1.066
G_G52         N3116655 MID N3344868 MID -1
G_G53         N3355872 MID N3126031 MID -1
G_G54         N2986947 MID N3355880 MID -2
G_G55         N3369111 MID N3128939 MID -6.667
G_G56         N2986973 MID N3369121 MID -1
G_G6          VSENSE MID CLAMP MID -1M
I_I_B         N2986935 MID DC 70P
I_I_OS        ESDN MID DC -70P
I_I_Q         VCC VEE DC 17U
R_R10         MID N3128929 R_NOISELESS 1
R_R11         MID N3128939 R_NOISELESS 1K
R_R12         N3130349 N3130359 R_NOISELESS 100MEG
R_R13         MID N3130359 R_NOISELESS 1
R_R139        N3116685 N3116675 R_NOISELESS 3.203107MEG
R_R14         MID N3130349 R_NOISELESS 120.1K
R_R140        N32898091 N3116685 R_NOISELESS 10K
R_R141        MID N3116675 R_NOISELESS 1
R_R142        N3116665 N3116655 R_NOISELESS 10K
R_R143        MID N3116655 R_NOISELESS 1
R_R144        MID N3116665 R_NOISELESS 126.68M
R_R15         N2986977 N2986957 R_NOISELESS 1M
R_R158        N3330030 N3330020 R_NOISELESS 10K
R_R159        MID N3330020 R_NOISELESS 1
R_R16         N2986981 N2986977 R_NOISELESS 1K
R_R160        MID N3330030 R_NOISELESS 29.36K
R_R161        MID N3108917 R_NOISELESS 1MEG
R_R162        MID N3108949 R_NOISELESS 1MEG
R_R167        N3116457 VCLP R_NOISELESS 100
R_R168        N3342059 N3202153 R_NOISELESS 10K
R_R169        MID N3202153 R_NOISELESS 1
R_R17         N2987013 ESDN R_NOISELESS 1M
R_R170        MID N3342059 R_NOISELESS 32.785714K
R_R171        MID N3108913 R_NOISELESS 1MEG
R_R18         MID N2987017 R_NOISELESS 1T
R_R19         MID N2987029 R_NOISELESS 1T
R_R190        N3236810 N3236820 R_NOISELESS 100MEG
R_R191        MID N3236810 R_NOISELESS 120.1K
R_R192        MID N3236820 R_NOISELESS 1
R_R193        MID N2986975 R_NOISELESS 1
R_R194        N3330567 N3330557 R_NOISELESS 10K
R_R195        MID N3330557 R_NOISELESS 1
R_R196        MID N3330567 R_NOISELESS 5.278K
R_R197        N3109045 N3331119 R_NOISELESS 10K
R_R198        MID N3331119 R_NOISELESS 1
R_R199        MID N3109045 R_NOISELESS 152.5K
R_R20         N2987037 MID R_NOISELESS 1
R_R200        N3344868 N3344856 R_NOISELESS 9.040298K
R_R201        N33449121 N3344868 R_NOISELESS 10K
R_R202        MID N3344856 R_NOISELESS 1
R_R203        N3355880 N3355872 R_NOISELESS 100MEG
R_R204        MID N3355872 R_NOISELESS 1
R_R205        MID N3355880 R_NOISELESS 100MEG
R_R206        MID N2986947 R_NOISELESS 1
R_R207        N3369121 N3369111 R_NOISELESS 100MEG
R_R208        MID N3369111 R_NOISELESS 1
R_R209        MID N3369121 R_NOISELESS 17.65MEG
R_R21         N2987051 N2987037 R_NOISELESS 1M
R_R210        MID N2986973 R_NOISELESS 1
R_R22         MID N2987061 R_NOISELESS 1MEG
R_R23         MID CLAMP R_NOISELESS 1MEG
R_R24         MID VSENSE R_NOISELESS 1K
R_R32         MID CLAW_CLAMP R_NOISELESS 1K
R_R33         MID CL_CLAMP R_NOISELESS 1K
R_R34         N3116515 N3116503 R_NOISELESS 10K
R_R35         MID N3116503 R_NOISELESS 1
R_R36         MID N3116515 R_NOISELESS 90.0605
R_R43         MID N3116957 R_NOISELESS 1
R_R46         VCC_B 0 R_NOISELESS 1
R_R47         VCC_B N2987785 R_NOISELESS 1M
R_R48         N2987785 N2987763 R_NOISELESS 1MEG
R_R49         N2987763 0 R_NOISELESS 1T
R_R5          MID N3126023 R_NOISELESS 1
R_R50         N2987763 N2987801 R_NOISELESS 1MEG
R_R51         N2987801 VEE_B R_NOISELESS 1M
R_R52         VEE_B 0 R_NOISELESS 1
R_R53         VCC_CLP MID R_NOISELESS 1T
R_R54         N2987123 MID R_NOISELESS 1
R_R55         N2987135 N2987123 R_NOISELESS 1M
R_R56         VEE_CLP MID R_NOISELESS 1T
R_R57         N2987157 MID R_NOISELESS 1
R_R58         N2987159 N2987157 R_NOISELESS 1M
R_R59         N2987201 MID R_NOISELESS 1T
R_R6          N3126031 N3126023 R_NOISELESS 100MEG
R_R60         N2987203 MID R_NOISELESS 1
R_R61         N2987205 N2987203 R_NOISELESS 1M
R_R62         N2987225 N2987231 R_NOISELESS 1M
R_R63         N2987243 MID R_NOISELESS 1T
R_R64         N2987231 MID R_NOISELESS 1
R_R65         N2987295 MID R_NOISELESS 1T
R_R66         N2987299 MID R_NOISELESS 1
R_R67         N2987301 N2987299 R_NOISELESS 1M
R_R68         N2987319 N2987325 R_NOISELESS 1M
R_R69         N2987337 MID R_NOISELESS 1T
R_R7          MID N3126031 R_NOISELESS 340
R_R70         N2987325 MID R_NOISELESS 1
R_R71         N2987363 VSENSE R_NOISELESS 1M
R_R72         VCC_B N2987391 R_NOISELESS 1K
R_R73         N2987391 N2987427 R_NOISELESS 1M
R_R74         N2987395 VEE_B R_NOISELESS 1K
R_R75         N2987395 N2987423 R_NOISELESS 1M
R_R76         MID VCC_CLP R_NOISELESS 1K
R_R77         VEE_CLP MID R_NOISELESS 1K
R_R78         N2987711 MID R_NOISELESS 1
R_R79         N2987687 MID R_NOISELESS 1
R_R8          N2986957 N2986949 R_NOISELESS 1K
R_R80         V11 N2987487 R_NOISELESS 100
R_R81         V12 N2987493 R_NOISELESS 100
R_R82         N2987499 MID R_NOISELESS 1
R_R83         N2987499 SW_OL_OPAx333 R_NOISELESS 100
R_R9          N3128939 N3128929 R_NOISELESS 100MEG
R_RDUMMY      MID N2987623 R_NOISELESS 38.339K
R_RS_INN      IN- ESDN R_NOISELESS 10M
R_RS_INP      IN+ ESDP R_NOISELESS 10M
R_RX          N2987623 N3116957 R_NOISELESS 383.39K
R_RX1         MID N2987541 R_NOISELESS 1T
R_RX2         VIMON N2987541 R_NOISELESS 100
R_RX3         MID N2987553 R_NOISELESS 1T
R_RX4         VOUT_S N2987553 R_NOISELESS 100
R_R_COM0      ESDP MID R_NOISELESS 1T
R_R_COM1      MID ESDN R_NOISELESS 1T
V_VCM_MAX     N2987017 VCC_B 100M
V_VCM_MIN     N2987029 VEE_B -100M
V_V_GRN       N2987337 MID -189
V_V_GRP       N2987295 MID 169
V_V_ISCN      N2987243 MID -9.9765
V_V_ISCP      N2987201 MID 5
V_V_ORN       N2987683 VCLP -10.9
V_V_ORP       N2987719 VCLP 10.9
X_H1          N2987623 OUT N2987541 MID BLOCK_DC_H1_OPAx333
X_H2          N2987675 N2987711 V12 MID BLOCK_DC_H2_OPAx333
X_H3          N2987655 N2987687 V11 MID BLOCK_DC_H3_OPAx333
X_S1          N2987655 CLAMP N2987655 CLAMP BLOCK_DC_S1_OPAx333
X_S2          CLAMP N2987675 CLAMP N2987675 BLOCK_DC_S2_OPAx333
X_U10         VCC_CLP VEE_CLP VOUT_S MID N2987123 N2987157 CLAMP_AMP_LO_OPAx333 PARAMS:
+  G=1
X_U11         N2987201 N2987243 VIMON MID N2987203 N2987231 CLAMP_AMP_LO_OPAx333
+  PARAMS: G=1
X_U12         N2987295 N2987337 N2987363 MID N2987299 N2987325 CLAMP_AMP_HI_OPAx333
+  PARAMS: G=10
X_U16         MID N2987499 N2987487 N2987493 OL_SENSE_OPAx333
X_U18         VIMON MID N2987391 VCC_B CLAWP_OPAx333
X_U19         MID VIMON VEE_B N2987395 CLAWN_OPAx333
X_U20         ESDN ESDP ESD_BB_OPAx333
X_U21         OUT VCC VEE ESD_OUT_OPAx333
X_U22         N2987205 N2987225 CL_CLAMP MID CL_SRC_OPAx333 PARAMS: GAIN=1 IPOS=0.676E2
+  INEG=-0.756E2
X_U23         N2987301 N2987319 CLAMP MID GR_SRC_OPAx333 PARAMS: GAIN=1 IPOS=0.6E2
+  INEG=-0.6E2
X_U25         SW_OL_OPAx333 MID N3116503 N3116515 SW_OL_OPAx333
X_U26         VIMON MID VCC MID IQ_SRC_OPAx333 PARAMS: GAIN=1E-3
X_U27         MID VIMON MID VEE IQ_SRC_OPAx333 PARAMS: GAIN=1E-3
X_U30         N2987051 N2987013 MID N2987061 AOL_1_OPAx333 PARAMS: GAIN=1E-4 IPOS=.5
+  INEG=-.5
X_U31         N2987061 MID MID CLAMP AOL_2_OPAx333 PARAMS: GAIN=0.03576 IPOS=0.325
+  INEG=-0.325
X_U32         N3116665 MID MID N3116957 ZO_SRC_OPAx333 PARAMS: GAIN=78939.8006 IPOS=4E4
+  INEG=-4E4
X_U35         N2987135 N2987159 CLAW_CLAMP MID CLAW_SRC_OPAx333 PARAMS: GAIN=1
+  IPOS=0.338E2 INEG=-0.378E2
X_U36         N2986935 MID FEMT_OPAx333 PARAMS: NVRF=100
X_U37         ESDN MID FEMT_OPAx333 PARAMS: NVRF=100
X_U38         ESDP N2986935 VNSE_OPAx333 PARAMS: NVR=55
X_U4          N2986949 N2986935 VOS_DRIFT_OPAx333 PARAMS: DC=-3.00E-06 POL=1
+  DRIFT=0.02E-06
X_U5          ESDN ESDP VCC VEE ESD_IN_OPAx333
X_U6          N2986981 MID N2987037 MID N2987017 N2987029 VCM_CLAMP_OPAx333 PARAMS:
+  GAIN=1
.ENDS OPAx333
*
.SUBCKT BLOCK_DC_H1_OPAx333 1 2 3 4
H_H1         3 4 VH_H1 1K
VH_H1         1 2 0V
.ENDS  BLOCK_DC_H1_OPAx333
*
.SUBCKT BLOCK_DC_H2_OPAx333 1 2 3 4
H_H2         3 4 VH_H2 1
VH_H2         1 2 0V
.ENDS  BLOCK_DC_H2_OPAx333
*
.SUBCKT BLOCK_DC_H3_OPAx333 1 2 3 4
H_H3         3 4 VH_H3 -1
VH_H3         1 2 0V
.ENDS  BLOCK_DC_H3_OPAx333
*
.SUBCKT BLOCK_DC_S1_OPAx333 1 2 3 4
S_S1         3 4 1 2 _S1
RS_S1         1 2 1G
.MODEL         _S1 VSWITCH ROFF=1E9 RON=10M VOFF=0.0V VON=10MV
.ENDS  BLOCK_DC_S1_OPAx333
*
.SUBCKT BLOCK_DC_S2_OPAx333 1 2 3 4
S_S2         3 4 1 2 _S2
RS_S2         1 2 1G
.MODEL         _S2 VSWITCH ROFF=1E9 RON=10M VOFF=0.0V VON=10MV
.ENDS  BLOCK_DC_S2_OPAx333
*
.SUBCKT AOL_1_OPAx333 VC+ VC- IOUT+ IOUT- PARAMS: GAIN=1E-4 IPOS=.5 INEG=-.5
G1 IOUT+ IOUT- VALUE={LIMIT(GAIN*V(VC+,VC-),INEG,IPOS)}
.ENDS  AOL_1_OPAx333
*
.SUBCKT AOL_2_OPAx333 VC+ VC- IOUT+ IOUT- PARAMS: GAIN=0.03576 IPOS=0.325 INEG=-0.325
G1 IOUT+ IOUT- VALUE={LIMIT(GAIN*V(VC+,VC-),INEG,IPOS)}
.ENDS  AOL_2_OPAx333
*
.SUBCKT CLAMP_AMP_HI_OPAx333 VC+ VC- VIN COM VO+ VO- PARAMS: G=10
GVO+ COM VO+ VALUE = {IF(V(VIN,COM)>V(VC+,COM),((V(VIN,COM)-V(VC+,COM))*G),0)}
GVO- COM VO- VALUE = {IF(V(VIN,COM)<V(VC-,COM),((V(VC-,COM)-V(VIN,COM))*G),0)}
.ENDS  CLAMP_AMP_HI_OPAx333
*
.SUBCKT CLAMP_AMP_LO_OPAx333 VC+ VC- VIN COM VO+ VO- PARAMS: G=1
GVO+ COM VO+ VALUE = {IF(V(VIN,COM)>V(VC+,COM),((V(VIN,COM)-V(VC+,COM))*G),0)}
GVO- COM VO- VALUE = {IF(V(VIN,COM)<V(VC-,COM),((V(VC-,COM)-V(VIN,COM))*G),0)}
.ENDS  CLAMP_AMP_LO_OPAx333
*
.SUBCKT CLAWN_OPAx333 VC+ VC- IOUT+ IOUT-
G1 IOUT+ IOUT- TABLE {(V(VC+,VC-))} =
+(0,    0.04076E-3)
+(0.5,      4.5E-5)
+(3.3255, 0.000160)
+(6.651,  0.000248)
+(8.868,  0.000328)
+(8.9789, 0.000345)
+(9.4223, 0.000361)
+(9.644,  0.000372)
+(9.8657, 0.000381)
+(9.9765, 0.000382)
.ENDS  CLAWN_OPAx333
*
.SUBCKT CLAWP_OPAx333 VC+ VC- IOUT+ IOUT-
G1 IOUT+ IOUT- TABLE {(V(VC+,VC-))} =
+(0,       0.04E-3)
+(1.651,  0.000184)
+(3.302,  0.000558)
+(4,       0.00075)
+(4.4027, 0.000985)
+(4.4577, 0.001026)
+(4.5678, 0.001152)
+(4.6779, 0.001350)
+(4.7879, 0.001796)
+(5,      0.002708)
.ENDS  CLAWP_OPAx333
*
.SUBCKT CLAW_SRC_OPAx333 VC+ VC- IOUT+ IOUT- PARAMS: GAIN=1 IPOS=0.338E2 INEG=-0.378E2
G1 IOUT+ IOUT- VALUE={LIMIT(GAIN*V(VC+,VC-),INEG,IPOS)}
.ENDS  CLAW_SRC_OPAx333
*
.SUBCKT CL_SRC_OPAx333 VC+ VC- IOUT+ IOUT- PARAMS: GAIN=1 IPOS=0.676E2 INEG=-0.756E2
G1 IOUT+ IOUT- VALUE={LIMIT(GAIN*V(VC+,VC-),INEG,IPOS)}
.ENDS  CL_SRC_OPAx333
*
.SUBCKT ESD_BB_OPAx333 ESDN ESDP
.MODEL ESD_SW VSWITCH(RON=50 ROFF=1E12 VON=700E-3 VOFF=650E-3)
S1 ESDN ESDP ESDN ESDP ESD_SW
S2 ESDP ESDN ESDP ESDN ESD_SW
.ENDS  ESD_BB_OPAx333
*
.SUBCKT ESD_IN_OPAx333 ESDN ESDP VCC VEE
.MODEL ESD_SW VSWITCH(RON=50 ROFF=1E12 VON=500E-3 VOFF=450E-3)
S1 ESDN VCC ESDN VCC ESD_SW
S2 ESDP VCC ESDP VCC ESD_SW
S3 VEE ESDN VEE ESDN ESD_SW
S4 VEE ESDP VEE ESDP ESD_SW
.ENDS  ESD_IN_OPAx333
*
.SUBCKT ESD_OUT_OPAx333 OUT VCC VEE
.MODEL ESD_SW VSWITCH(RON=50 ROFF=1E12 VON=500E-3 VOFF=450E-3)
S1 OUT VCC OUT VCC ESD_SW
S2 VEE OUT VEE OUT ESD_SW
.ENDS  ESD_OUT_OPAx333
*
.SUBCKT FEMT_OPAx333 1 2 PARAMS: NVRF=100
E1 3 0 5 0 10
R1 5 0 {1.184*PWR(NVRF,2)}
R2 5 0 {1.184*PWR(NVRF,2)}
G1 1 2 3 0 1E-6
.ENDS  FEMT_OPAx333
*
.SUBCKT GR_SRC_OPAx333 VC+ VC- IOUT+ IOUT- PARAMS: GAIN=1 IPOS=0.6E2 INEG=-0.6E2
G1 IOUT+ IOUT- VALUE={LIMIT(GAIN*V(VC+,VC-),INEG,IPOS)}
.ENDS  GR_SRC_OPAx333
*
.SUBCKT IQ_SRC_OPAx333 VC+ VC- IOUT+ IOUT- PARAMS: GAIN=1E-3
G1 IOUT+ IOUT- VALUE={IF( (V(VC+,VC-)<=0),0,GAIN*V(VC+,VC-) )}
.ENDS  IQ_SRC_OPAx333
*
.SUBCKT OL_SENSE_OPAx333 COM SW+ OLN OLP
GSW+ COM SW+ VALUE = {IF((V(OLN,COM)>10E-3 | V(OLP,COM)>10E-3),1,0)}
.ENDS  OL_SENSE_OPAx333
*
.SUBCKT SW_OL_OPAx333 SW_OL_OPAx333 MID CAP_L CAP_R
.MODEL OL_SW VSWITCH(RON=1E-3 ROFF=1E9 VON=900E-3 VOFF=800E-3)
S1 CAP_L CAP_R SW_OL_OPAx333 MID OL_SW
.ENDS  SW_OL_OPAx333
*
.SUBCKT VCM_CLAMP_OPAx333 VIN+ VIN- IOUT- IOUT+ VP+ VP- PARAMS: GAIN=1
G1 IOUT+ IOUT- VALUE={LIMIT(GAIN*V(VIN+,VIN-),V(VP-,VIN-), V(VP+,VIN-))}
.ENDS  VCM_CLAMP_OPAx333
*
.SUBCKT VNSE_OPAx333 1 2 PARAMS: NVR=55
R4 5 0 {1.184*PWR(NVR,2)}
R5 5 0 {1.184*PWR(NVR,2)}
E3 1 2 5 0 10
.ENDS  VNSE_OPAx333
*
.SUBCKT VOS_DRIFT_OPAx333 VOS+ VOS- PARAMS: DC=-3.50E-06 POL=1 DRIFT=0.02E-06
E1 VOS+ VOS- VALUE={DC+POL*DRIFT*(TEMP-27)}
.ENDS  VOS_DRIFT_OPAx333
*
.SUBCKT ZO_SRC_OPAx333 VC+ VC- IOUT+ IOUT- PARAMS: GAIN=78939.8006 IPOS=4E4 INEG=-4E4
G1 IOUT+ IOUT- VALUE={LIMIT(GAIN*V(VC+,VC-),INEG,IPOS)}
.ENDS  ZO_SRC_OPAx333
*
.MODEL R_NOISELESS RES (T_ABS=-273.15)
*
.backanno
.end